# EasyEDA Pro project Jalousee PCB.eprj, schematic Schematic1
Create Date: 2023-09-13; Page Name: P1; Project Name: Jalousee PCB; Schematic Name: Schematic1; Update Date: 2023-09-13; Company: EasyEDA.com; Drawed: EasyEDA Pro; Page Size: A4; Part Number: JLCPCB-002; Reviewed: EasyEDA Pro; Version: V0.1
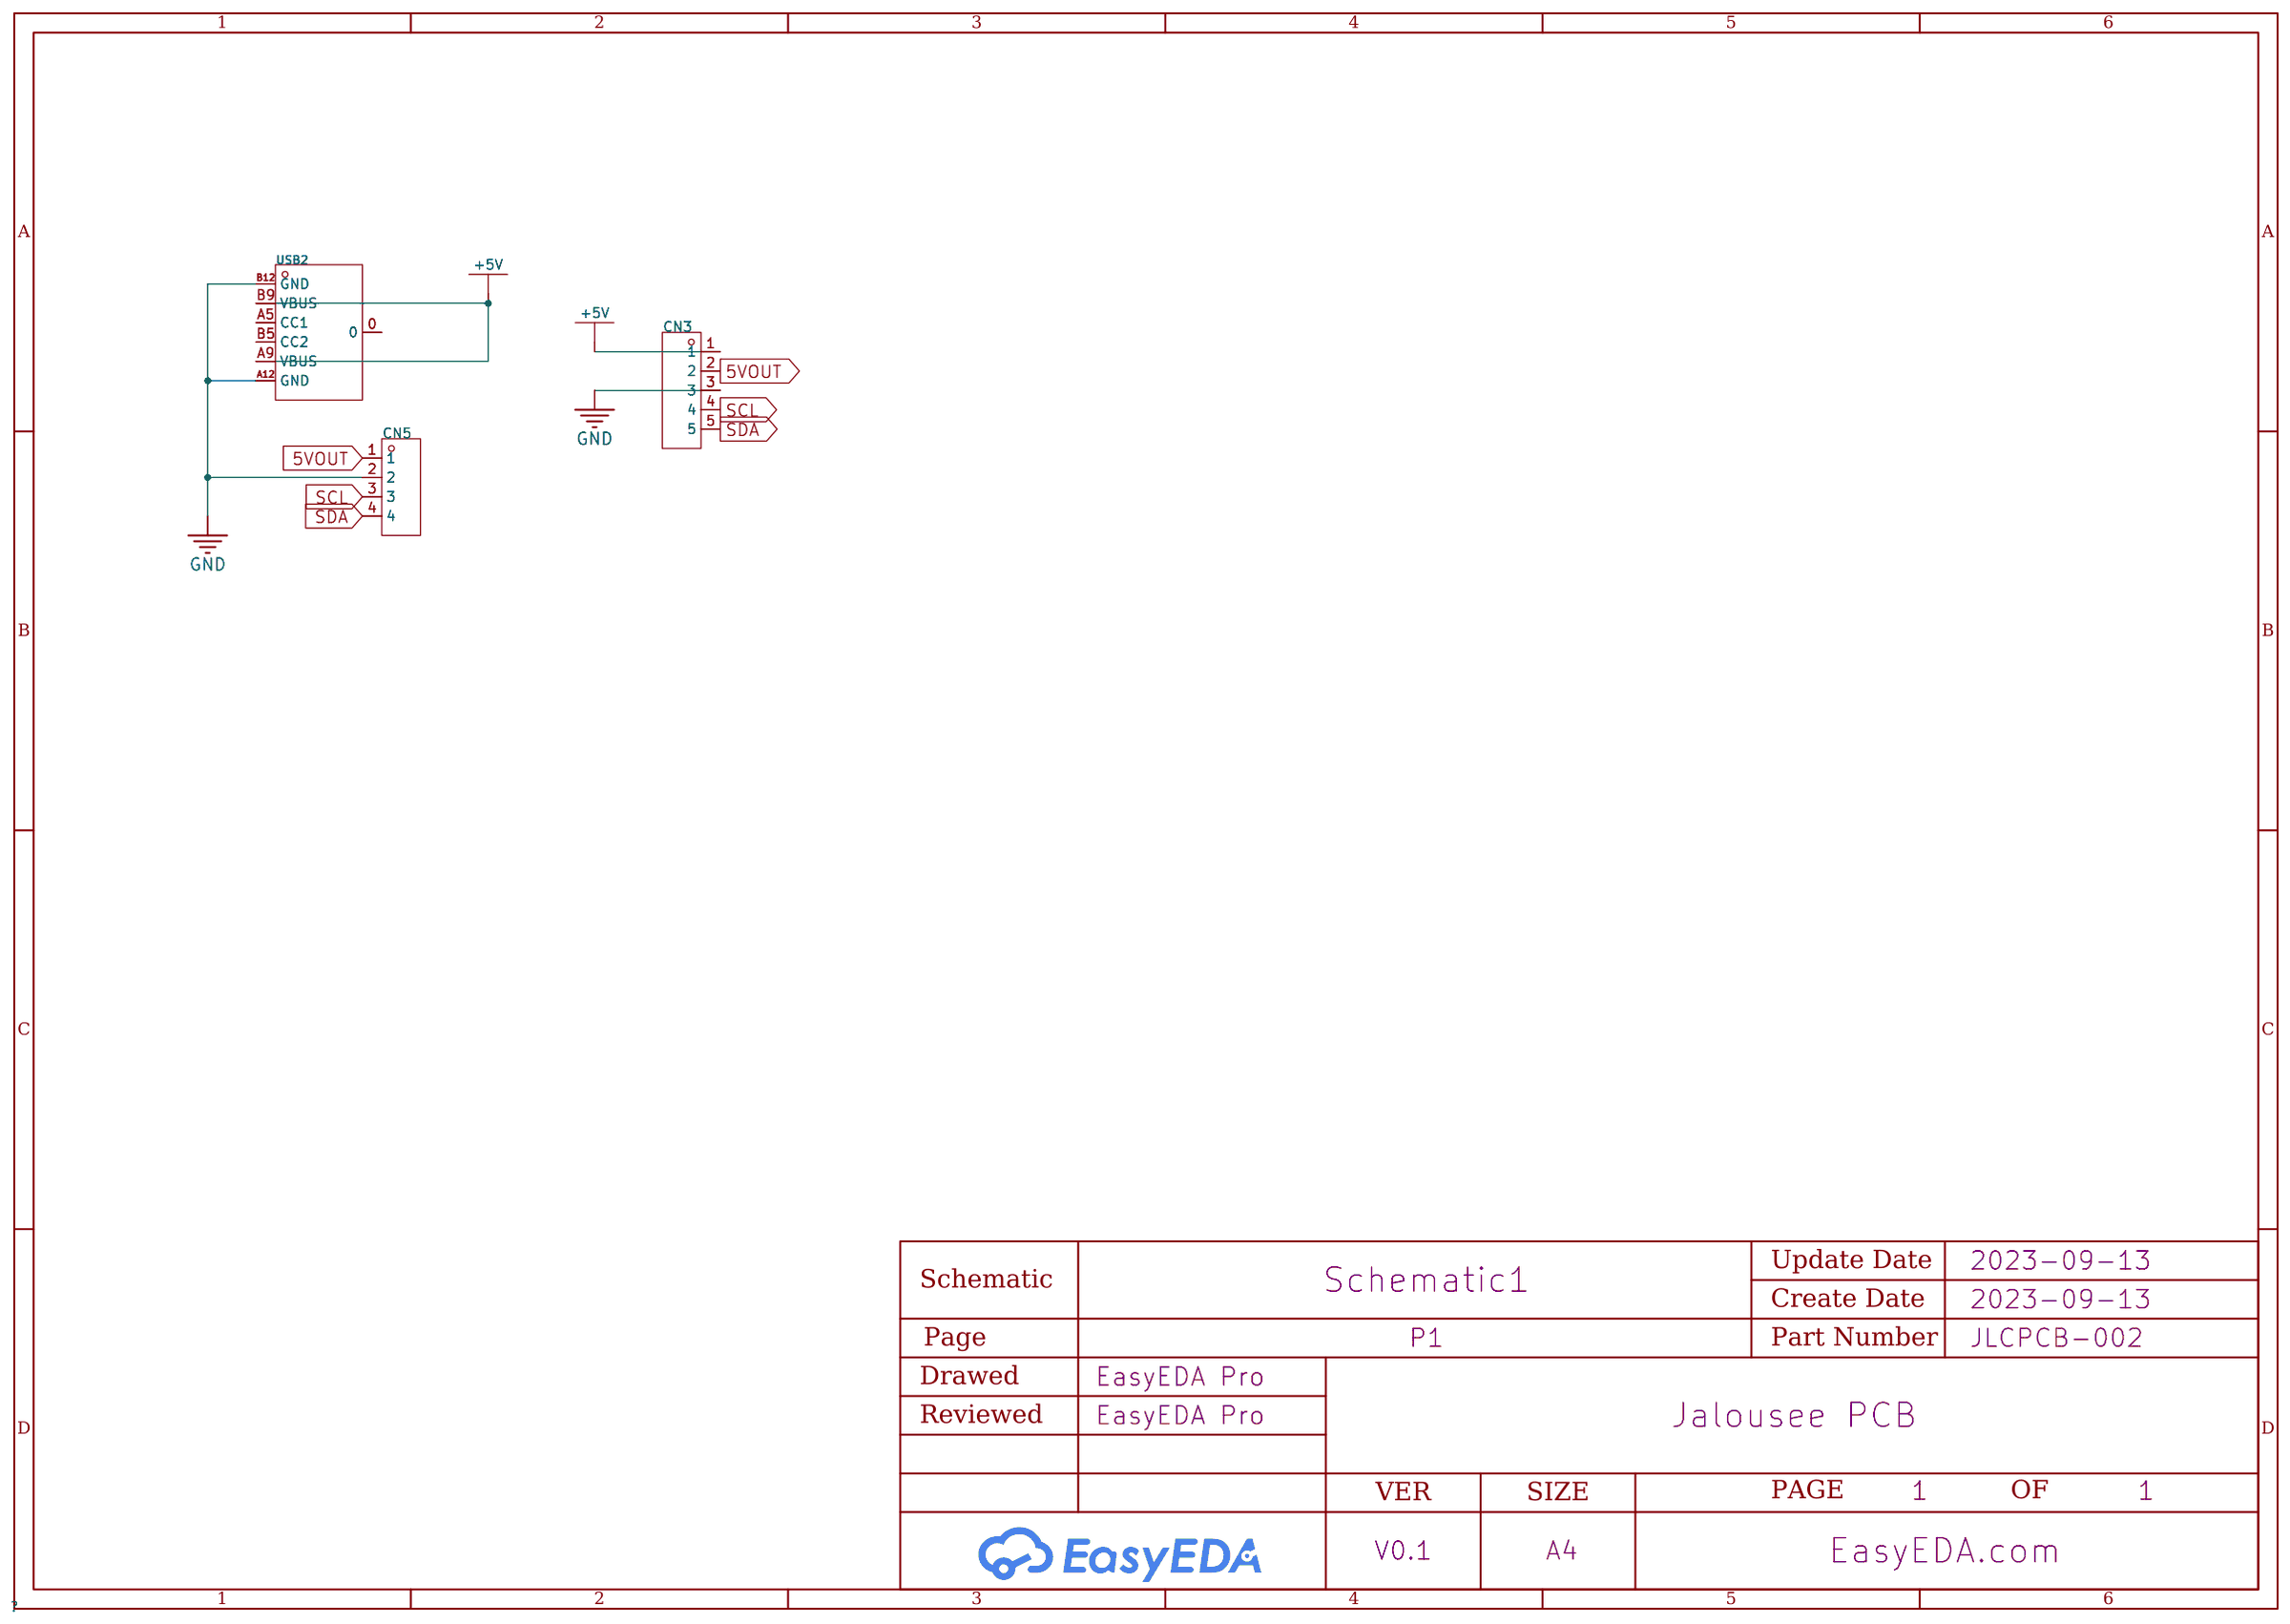
[diagram p5: schematic sheet]

## Parts
CN3  HC-1.25-5A  [CONN-TH_5P-P1.25_HCTL_HC-1.25-5A]
CN5  HC-1.25-4AW  [CONN-TH_4P-P1.25_HCTL_HC-1.25-4AW]
USB2  USB-TYPE-C-015  [USB-C-SMD_TYPE-C--015]

## Library data of the parts
CN3 = HC-1.25-5A: Reference Series:- Pitch:1.25mm Pins Structure:1x5P Number of Rows:1 Number of PINs Per Row:5 Row Spacing:- Gender:公型插针 Mounting Style:Straight Current Rating (Max):1A Operating Temperature Range:-25℃~+85℃ Operating Temperature Range:-25℃~+85℃; LCSC Part Name: 1.25mm 1x5P 直插; Supplier Part: C2845523; Manufacturer: HCTL(华灿天禄); Supplier Footprint: 直插,P=1.25mm; JLCPCB Part Class: Extended Part; Datasheet: https://atta.szlcsc.com/upload/public/pdf/source/20210729/C2845520_89EAA22C8D4DE2FB8A253230326912FB.pdf; Supplier: LCSC; Pitch: 1.25mm; Pins Structure: 1x5P; Number of Rows: 1; Number of PINs Per Row: 5; Gender: 公型插针; Mounting Style: Straight; Current Rating (Max): 1A; Operating Temperature Range: -25℃~+85℃
CN5 = HC-1.25-4AW: Reference Series:- Pitch:1.25mm Pins Structure:1x4P Number of Rows:1 Number of PINs Per Row:4 Row Spacing:- Gender:公型插针 Mounting Style:Shrouded Current Rating (Max):1A Operating Temperature Range:-25℃~+85℃ Operating Temperature Range:-25℃~+85℃; LCSC Part Name: 1.25mm 1x4P 弯插; Supplier Part: C2845537; Manufacturer: HCTL(华灿天禄); Supplier Footprint: 插件,P=1.25mm; JLCPCB Part Class: Extended Part; Datasheet: https://atta.szlcsc.com/upload/public/pdf/source/20210729/C2845535_17B4C65D5133EDBE0A07B8E05D9E3662.pdf; Supplier: LCSC; Pitch: 1.25mm; Pins Structure: 1x4P; Number of Rows: 1; Number of PINs Per Row: 4; Gender: 公型插针; Mounting Style: Shrouded; Current Rating (Max): 1A; Operating Temperature Range: -25℃~+85℃
USB2 = USB-TYPE-C-015: Connector Type:Type-C Standard:- Gender:Female Number of Contacts:6P Number of Ports:1 Mounting Style:Brick nogging Current Rating - Power (Max):3A Operating Temperature Range:-25℃~+85℃ Operating Temperature Range:-25℃~+85℃; LCSC Part Name: Type-C 母座 立贴 立贴; Supplier Part: C2927035; Manufacturer: DEALON(德艺隆); Supplier Footprint: SMD; JLCPCB Part Class: Extended Part; Datasheet: https://atta.szlcsc.com/upload/public/pdf/source/20211217/E01574439A69546B11C902AF66442695.pdf; Supplier: LCSC; Connector Type: Type-C; Gender: Female; Number of Contacts: 6P; Number of Ports: 1; Mounting Style: Brick nogging; Current Rating - Power (Max): 3A; Operating Temperature Range: -25℃~+85℃

## Nets
5VOUT: CN3.2 CN5.1
+5V: CN3.1 USB2.A9(VBUS) USB2.B9(VBUS)
GND: CN3.3 CN5.2 USB2.A12(GND) USB2.B12(GND)
SCL: CN3.4 CN5.3
SDA: CN3.5 CN5.4

Not connected (* = marked no-connect by the designer): USB2 0 A5(CC1) B5(CC2)
